# Altium schematic sheet P05_ Debugger.SchDoc
size A4; SheetNumber: 5; SheetTotal: 7
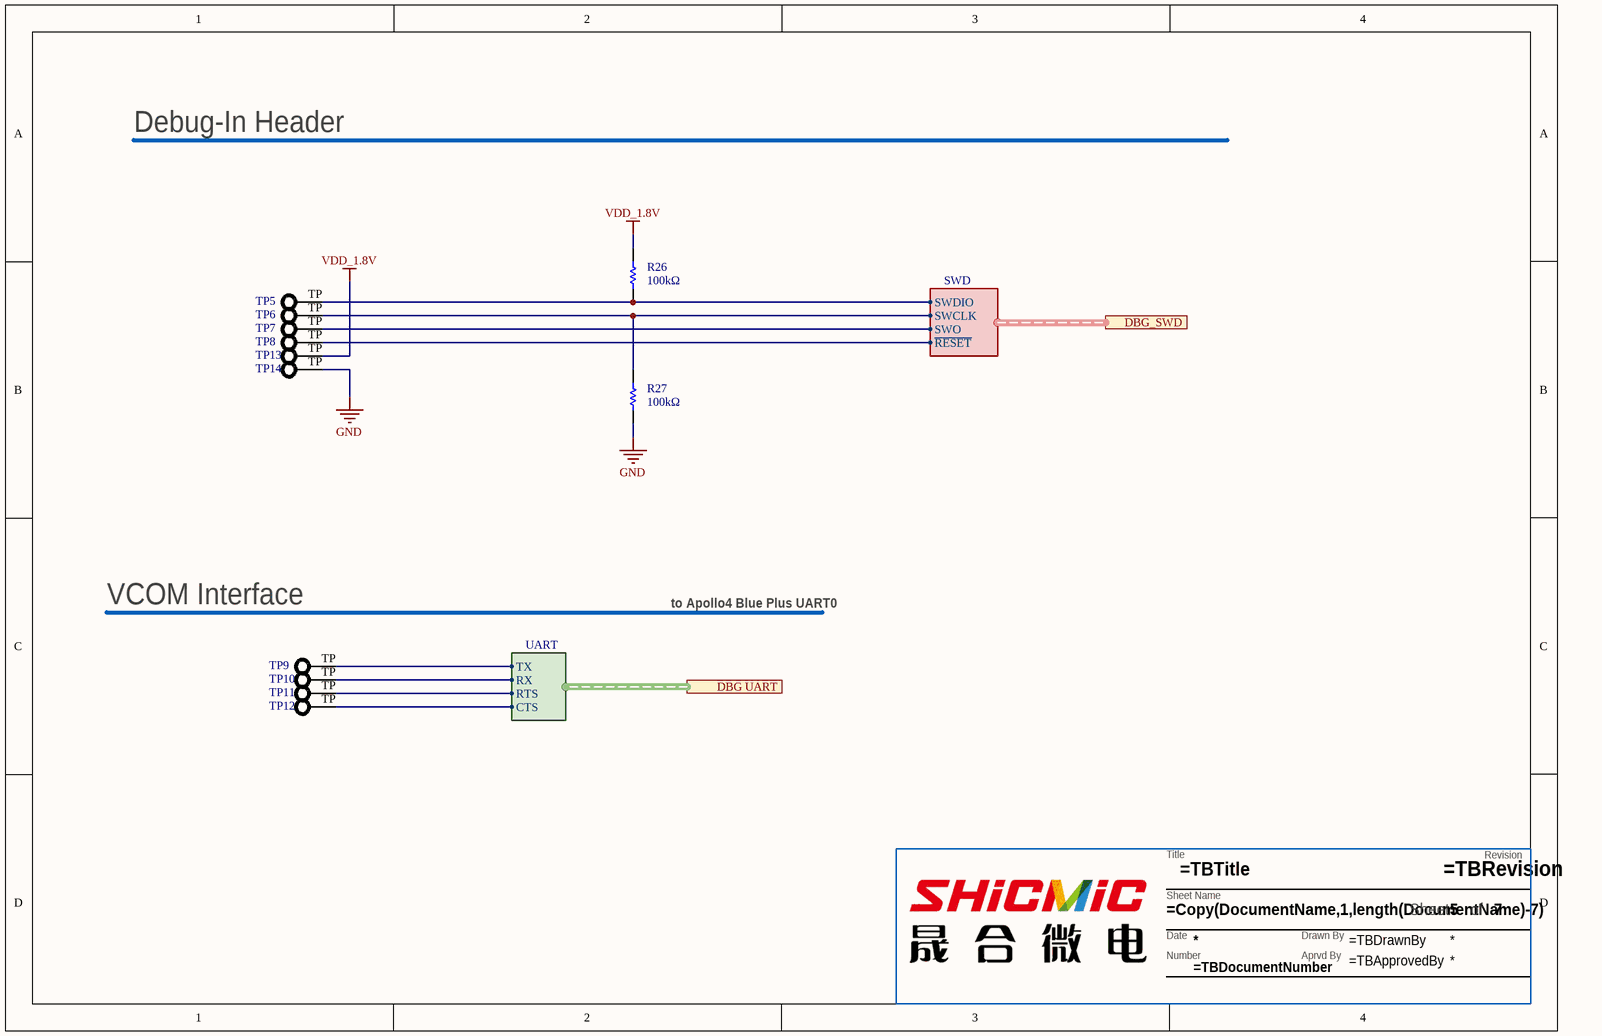
[diagram p0: P05_ Debugger.SchDoc]

## Parts
??  TitleBlock  (value not drawn)  (graphical)
R26  100kΩ  [RES_0402]
R27  100kΩ  [RES_0402]
TP5  PAD  [TPPAD_1.0mm]  (value not drawn)  (no BOM)
TP6  PAD  [TPPAD_1.0mm]  (value not drawn)  (no BOM)
TP7  PAD  [TPPAD_1.0mm]  (value not drawn)  (no BOM)
TP8  PAD  [TPPAD_1.0mm]  (value not drawn)  (no BOM)
TP9  PAD  [TPPAD_1.0mm]  (value not drawn)  (no BOM)
TP10  PAD  [TPPAD_1.0mm]  (value not drawn)  (no BOM)
TP11  PAD  [TPPAD_1.0mm]  (value not drawn)  (no BOM)
TP12  PAD  [TPPAD_1.0mm]  (value not drawn)  (no BOM)
TP13  PAD  [TPPAD_1.0mm]  (value not drawn)  (no BOM)
TP14  PAD  [TPPAD_1.0mm]  (value not drawn)  (no BOM)

## Ports
DBG UART (harness UART), DBG_SWD (harness SWD)

## Harnesses
UART: TX, RX, RTS, CTS
SWD: SWCLK, SWDIO, SWO, ~{RESET}

## Nets
GND: R27.1 TP14.TP
VDD_1.8V: R26.2 TP13.TP
NetR26_1: R26.1 TP5.TP ; port DBG_SWD.SWDIO
NetR27_2: R27.2 TP6.TP ; port DBG_SWD.SWCLK
NetTP7_TP: TP7.TP ; port DBG_SWD.SWO
NetTP8_TP: TP8.TP ; port DBG_SWD.~{RESET}
NetTP9_TP: TP9.TP ; port DBG UART.TX
NetTP10_TP: TP10.TP ; port DBG UART.RX
NetTP12_TP: TP12.TP ; port DBG UART.CTS

Not connected (* = marked no-connect by the designer): TP11 TP

## Notes on the sheet
- Debug-In Header
- VCOM Interface
- to Apollo4 Blue Plus UART0
- (in symbol TitleBlock) Revision; Title; Sheet Name; Sheet; of; Date; Drawn By; Number; Aprvd By

## Library data of the parts
?? = TitleBlock: Title block for Ambiq Schematics. Please have the following parameters entered in Project>Project Options>Parameters: / TBTitle / TBDocumentNumber / TBRevision / TBDrawnBy / TBApprovedBy; AMBIQ PN: TitleBlock
R26 R27 = Resistor: RES SMD 100K OHM 1% 1/10W 0402; Manufacturer: Panasonic; AMBIQ PN: ERJ-2RKF1003X; Resistance: 100kR; Power Rating: 100mW; Voltage Rating: 50V; Temperature Coefficient: 100ppm/°C; Supplier 1: Arrow Electronics; Supplier Part Number 1: ERJ-2RKF1003X; Manufacturer Part Number: ERJ-2RKF1003X; RoHS: Yes; Category: Chip SMD Resistors; Stock 1: 267708; Pricing 1: 10000=0.00840 (USD); Mount: Surface Mount; Case/Package: 0402; Weight: 0.000388oz; Case Code (Metric): 1005; Case Code (Imperial): 0402; Contact Plating: Tin; Min Operating Temperature: -55°C; Max Operating Temperature: 155°C; Package Quantity: 10000; Packaging: Cut Tape; Resistor Type: Thick Film; Number of Terminations: 2; Termination: SMD/SMT; Max Power Dissipation: 100mW; Voltage Rating (DC): 50V; Features: Automotive AEC-Q200; Series: ERJ-2Rx; Technology: THICK FILM; Length: 1mm; Width: 0.5mm; Height: 0.35mm; Depth: 0.5mm; Radiation Hardening: No; REACH SVHC: No SVHC; Military Standard: Not; Lead Free: Lead Free; RoHS Compliant: Yes; ComponentLink1URL: https://datasheet.ciiva.com/34303/1987038-34303550.pdf?src-supplier=Jameco; ComponentLink1Description: https://datasheet.ciiva.com/34303/1987038-34303550.pdf?src-supplier=Jameco; ComponentLink2URL: https://datasheet.ciiva.com/11821/0900766b80f80784-11821175.pdf?src-supplier=RSComponents; ComponentLink2Description: https://datasheet.ciiva.com/11821/0900766b80f80784-11821175.pdf?src-supplier=RSComponents; ComponentLink3URL: https://datasheet.ciiva.com/7830/aoa0000ce2-7830725.pdf?src-supplier=Element14; Tolerance: 1%; Number of Pins: 2
TP5-TP14 = TP_PAD: None; AMBIQ PN: TP_PAD